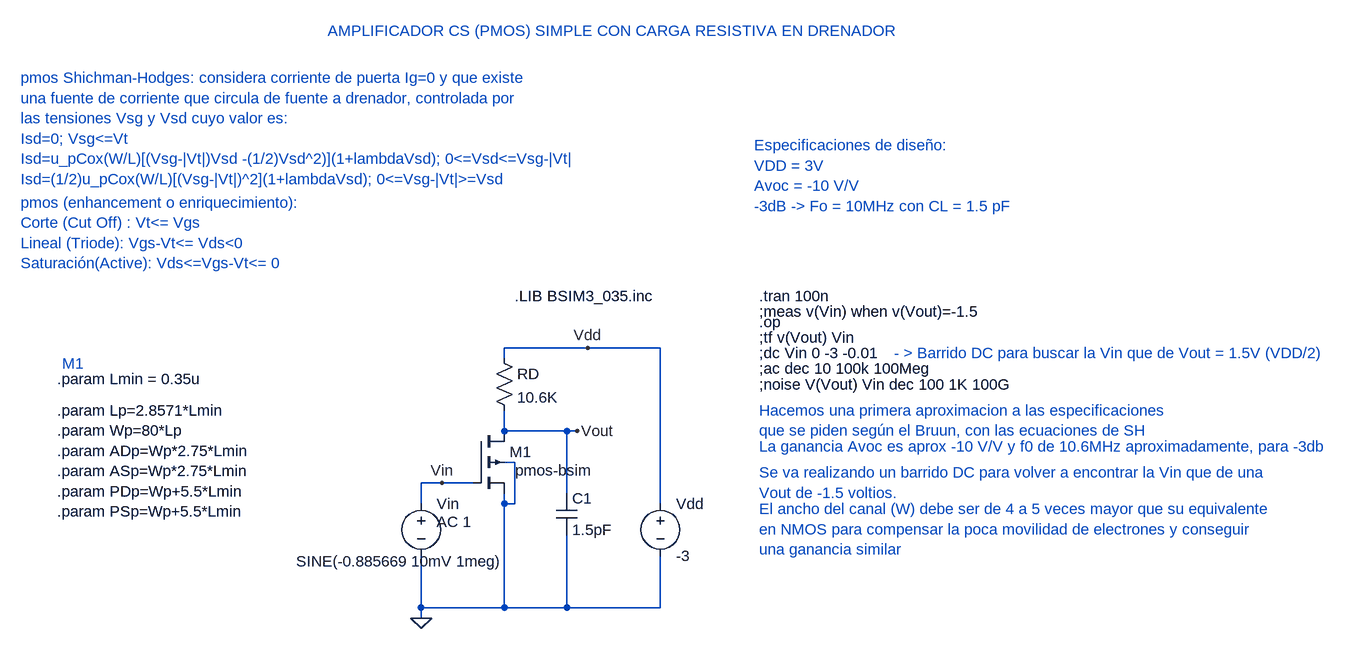
[diagram p0: schematic PMOS_CS_RD.asc]
PMOS_CS_RD.asc, the LTspice schematic file:
Version 4
SHEET 1 1992 680
WIRE 768 112 640 112
WIRE 880 112 768 112
WIRE 640 128 640 112
WIRE 640 240 640 208
WIRE 736 240 640 240
WIRE 752 240 736 240
WIRE 656 288 640 288
WIRE 544 320 512 320
WIRE 592 320 544 320
WIRE 736 336 736 240
WIRE 512 352 512 320
WIRE 640 352 640 336
WIRE 656 352 656 288
WIRE 656 352 640 352
WIRE 880 352 880 112
WIRE 512 512 512 432
WIRE 640 512 640 352
WIRE 640 512 512 512
WIRE 736 512 736 400
WIRE 736 512 640 512
WIRE 880 512 880 432
WIRE 880 512 736 512
WIRE 512 528 512 512
FLAG 512 528 0
FLAG 752 240 Vout
FLAG 544 320 Vin
FLAG 768 112 Vdd
SYMBOL pmos4 592 240 R0
WINDOW 3 65 61 Left 2
SYMATTR Value pmos-bsim
SYMATTR InstName M1
SYMATTR Value2 l={Lp} w={Wp} ad={ADp} as={ASp} pd={PDp} ps={PSp} m=1
SYMBOL voltage 512 336 R0
WINDOW 3 -192 105 Left 2
WINDOW 123 24 44 Left 2
WINDOW 39 0 0 Left 0
SYMATTR Value SINE(-0.885669 10mV 1meg)
SYMATTR Value2 AC 1
SYMATTR InstName Vin
SYMBOL voltage 880 336 R0
WINDOW 123 0 0 Left 0
WINDOW 39 0 0 Left 0
SYMATTR InstName Vdd
SYMATTR Value -3
SYMBOL res 624 112 R0
SYMATTR InstName RD
SYMATTR Value 10.6K
SYMBOL cap 720 336 R0
SYMATTR InstName C1
SYMATTR Value 1.5pF
TEXT -104 -112 Left 2 ;pmos (enhancement o enriquecimiento):\nCorte (Cut Off) : Vt<= Vgs\nLineal (Triode): Vgs-Vt<= Vds<0\nSaturación(Active): Vds<=Vgs-Vt<= 0
TEXT -104 -304 Left 2 ;pmos Shichman-Hodges: considera corriente de puerta Ig=0 y que existe\nuna fuente de corriente que circula de fuente a drenador, controlada por\nlas tensiones Vsg y Vsd cuyo valor es:\nIsd=0; Vsg<=Vt\nIsd=u_pCox(W/L)[(Vsg-|Vt|)Vsd -(1/2)Vsd^2)](1+lambdaVsd); 0<=Vsd<=Vsg-|Vt|\nIsd=(1/2)u_pCox(W/L)[(Vsg-|Vt|)^2](1+lambdaVsd); 0<=Vsg-|Vt|>=Vsd
TEXT 1024 -200 Left 2 ;Especificaciones de diseño:\nVDD = 3V\nAvoc = -10 V/V\n-3dB -> Fo = 10MHz con CL = 1.5 pF
TEXT -48 208 Left 2 !.param Lp=2.8571*Lmin\n.param Wp=80*Lp\n.param ADp=Wp*2.75*Lmin\n.param ASp=Wp*2.75*Lmin\n.param PDp=Wp+5.5*Lmin\n.param PSp=Wp+5.5*Lmin
TEXT -48 160 Left 2 !.param Lmin = 0.35u
TEXT 1032 72 Left 2 !.op
TEXT 1032 96 Left 2 !;tf v(Vout) Vin
TEXT 1032 120 Left 2 !;dc Vin 0 -3 -0.01
TEXT 1032 144 Left 2 !;ac dec 10 100k 100Meg
TEXT 1240 120 Left 2 ;- > Barrido DC para buscar la Vin que de Vout = 1.5V (VDD/2)
TEXT 1032 208 Left 2 ;Hacemos una primera aproximacion a las especificaciones\nque se piden según el Bruun, con las ecuaciones de SH
TEXT 1032 264 Left 2 ;La ganancia Avoc es aprox -10 V/V y f0 de 10.6MHz aproximadamente, para -3db
TEXT 1032 304 Left 2 ;Se va realizando un barrido DC para volver a encontrar la Vin que de una\nVout de -1.5 voltios.
TEXT 656 32 Left 2 !.LIB BSIM3_035.inc
TEXT 1032 360 Left 2 ;El ancho del canal (W) debe ser de 4 a 5 veces mayor que su equivalente\nen NMOS para compensar la poca movilidad de electrones y conseguir\nuna ganancia similar
TEXT 368 -376 Left 2 ;AMPLIFICADOR CS (PMOS) SIMPLE CON CARGA RESISTIVA EN DRENADOR
TEXT 1032 56 Left 2 !;meas v(Vin) when v(Vout)=-1.5
TEXT -40 136 Left 2 ;M1
TEXT 1032 168 Left 2 !;noise V(Vout) Vin dec 100 1K 100G
TEXT 1032 32 Left 2 !.tran 100n

The netlist it stands for:
* PMOS_CS_RD.asc
M1 Vout Vin 0 0 pmos-bsim l={Lp} w={Wp} ad={ADp} as={ASp} pd={PDp} ps={PSp} m=1
Vin Vin 0 SINE(-0.885669 10mV 1meg) AC 1
Vdd Vdd 0 -3
RD Vdd Vout 10.6K
C1 Vout 0 1.5pF
.model NMOS NMOS
.model PMOS PMOS
.lib standard.mos
* pmos (enhancement o enriquecimiento):
* Corte (Cut Off) : Vt<= Vgs
* Lineal (Triode): Vgs-Vt<= Vds<0
* Saturación(Active): Vds<=Vgs-Vt<= 0
* pmos Shichman-Hodges: considera corriente de puerta Ig=0 y que existe
* una fuente de corriente que circula de fuente a drenador, controlada por
* las tensiones Vsg y Vsd cuyo valor es:
* Isd=0; Vsg<=Vt
* Isd=u_pCox(W/L)[(Vsg-|Vt|)Vsd -(1/2)Vsd^2)](1+lambdaVsd); 0<=Vsd<=Vsg-|Vt|
* Isd=(1/2)u_pCox(W/L)[(Vsg-|Vt|)^2](1+lambdaVsd); 0<=Vsg-|Vt|>=Vsd
* Especificaciones de diseño:
* VDD = 3V
* Avoc = -10 V/V
* -3dB -> Fo = 10MHz con CL = 1.5 pF
.param Lp=2.8571*Lmin
.param Wp=80*Lp
.param ADp=Wp*2.75*Lmin
.param ASp=Wp*2.75*Lmin
.param PDp=Wp+5.5*Lmin
.param PSp=Wp+5.5*Lmin
.param Lmin = 0.35u
.op
;tf v(Vout) Vin
;dc Vin 0 -3 -0.01
;ac dec 10 100k 100Meg
* - > Barrido DC para buscar la Vin que de Vout = 1.5V (VDD/2)
* Hacemos una primera aproximacion a las especificaciones
* que se piden según el Bruun, con las ecuaciones de SH
* La ganancia Avoc es aprox -10 V/V y f0 de 10.6MHz aproximadamente, para -3db
* Se va realizando un barrido DC para volver a encontrar la Vin que de una
* Vout de -1.5 voltios.
.LIB BSIM3_035.inc
* El ancho del canal (W) debe ser de 4 a 5 veces mayor que su equivalente
* en NMOS para compensar la poca movilidad de electrones y conseguir
* una ganancia similar
* AMPLIFICADOR CS (PMOS) SIMPLE CON CARGA RESISTIVA EN DRENADOR
;meas v(Vin) when v(Vout)=-1.5
* M1
;noise V(Vout) Vin dec 100 1K 100G
.tran 100n
.backanno
.end